# Altium project usb_uart_converter.PrjPCB
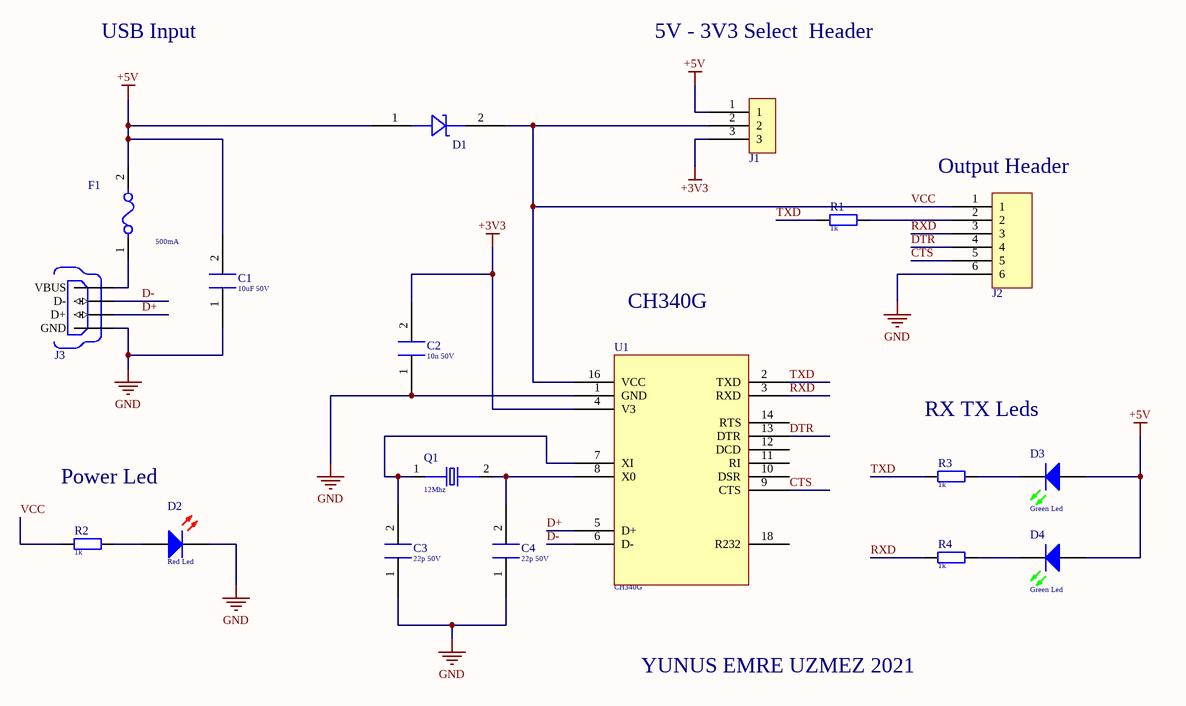
[diagram p0: usb_uart_converter.SchDoc]
1 sheet, 18 parts. Net scope: global (net labels, ports and power ports of the same name join across sheets).
Board file: usb_uart_converter.PcbDoc

## Sheet usb_uart_converter.SchDoc
size A4

### Parts
C1  value 10uF 50V  [CAP 0805]  (hidden comment: 10uF C0805)
C2  value 10n 50V  [CAP 0805]  (hidden comment: 10n C0805)
C3  value 22p 50V  [CAP 0805]  (hidden comment: 22p C0805)
C4  value 22p 50V  [CAP 0805]  (hidden comment: 22p C0805)
D1  MMSZ4668T1G  [SOD-123]  (value not drawn)
D2  Name: Red Led  [LED RED 0805]  (hidden comment: Led Red)
D3  Name: Green Led  [LED GREEN 0805]  (hidden comment: Led Green)
D4  Name: Green Led  [LED GREEN 0805]  (hidden comment: Led Green)
F1  value 500mA  [FUSE]  (hidden comment: 0.5A Fuse)
J1  1x3 Header  [1x3 HEADER]  (value not drawn)
J2  Header 1x6  [1X6 HEADER]  (value not drawn)
J3  USB  [USB TYPE A]  (value not drawn)
Q1  value 12Mhz  [OSCILLATOR]  (hidden comment: 12 MHz Oscillator)
R1  value 1k  [RES 0805]  (hidden comment: 0.33K R0805)
R2  value 1k  [RES 0805]  (hidden comment: 0.33K R0805)
R3  value 1k  [RES 0805]  (hidden comment: 0.33K R0805)
R4  value 1k  [RES 0805]  (hidden comment: 0.33K R0805)
U1  CH340G  [SOP-16]

### Nets
+3V3: C2.2 J1.3 U1.4(V3)
+5V: C1.2 D1.1 D3.1(A) D4.1(A) F1.2 J1.1
GND: C1.1 C2.1 C3.1 C4.1 D2.2(K) J2.6 J3.4(GND) U1.1(GND)
CTS: J2.5 U1.9(CTS)
D+: J3.3(D+) U1.5(D+)
D-: J3.2(D-) U1.6(D-)
DTR: J2.4 U1.13(DTR)
RXD: J2.3 R4.1 U1.3(RXD)
TXD: R1.1 R3.1 U1.2(TXD)
VCC: D1.2 J1.2 J2.1 R2.1 U1.16(VCC)
NetC3_2: C3.2 Q1.1 U1.7(XI)
NetC4_2: C4.2 Q1.2 U1.8(X0)
NetD2_1: D2.1(A) R2.2
NetD3_2: D3.2(K) R3.2
NetD4_2: D4.2(K) R4.2
NetF1_1: F1.1 J3.1(VBUS)
NetJ2_2: J2.2 R1.2

Not connected (* = marked no-connect by the designer): U1 10(DSR) 11(RI) 12(DCD) 14(RTS) 18(R232)

### Notes on the sheet
- USB Input
- 5V - 3V3 Select  Header
- (near J2) Output Header
- CH340G
- RX TX Leds
- Power Led
- YUNUS EMRE UZMEZ 2021

### Library data of the parts
U1 = CH340G: Name: CH340G